# Altium schematic sheet MASTER_BLOXK.SchDoc
size B; SheetNumber: 2; SheetTotal: 5
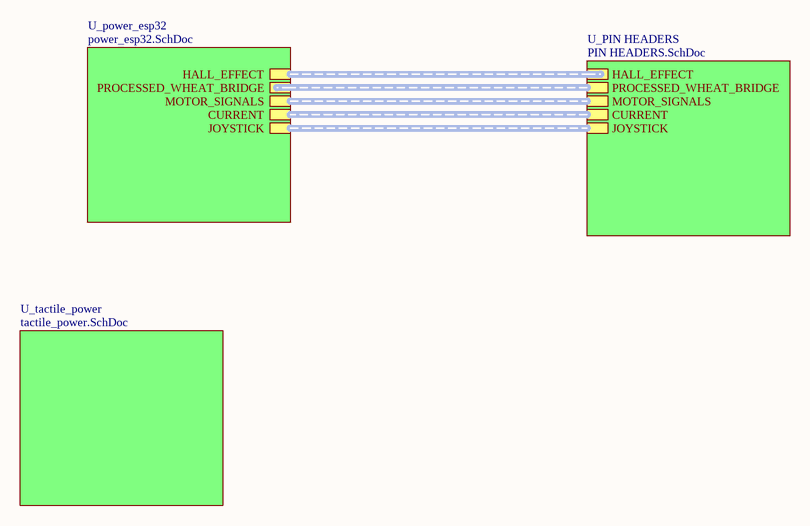
[diagram p0: MASTER_BLOXK.SchDoc]

## Sub-sheets
U_PIN HEADERS = PIN HEADERS.SchDoc: HALL_EFFECT (harness HALL_EFFECT), PROCESSED_WHEAT_BRIDGE (harness PROCES WHEAT_BRIDGE), CURRENT (harness current_sensors), MOTOR_SIGNALS (harness MOTOR_SIGNALS), JOYSTICK (harness JOY_STICK_)
U_power_esp32 = power_esp32.SchDoc: HALL_EFFECT (harness HALL_EFFECT), PROCESSED_WHEAT_BRIDGE (harness PROCES WHEAT_BRIDGE), MOTOR_SIGNALS (harness MOTOR_SIGNALS), CURRENT (harness current_sensors), JOYSTICK (harness JOY_STICK_)
U_tactile_power = tactile_power.SchDoc: no entries

## Buses and harness runs
harness sheet U_PIN HEADERS/CURRENT = sheet U_power_esp32/CURRENT
harness sheet U_PIN HEADERS/HALL_EFFECT = sheet U_power_esp32/HALL_EFFECT
harness sheet U_PIN HEADERS/JOYSTICK = sheet U_power_esp32/JOYSTICK
harness sheet U_PIN HEADERS/MOTOR_SIGNALS = sheet U_power_esp32/MOTOR_SIGNALS
harness sheet U_PIN HEADERS/PROCESSED_WHEAT_BRIDGE = sheet U_power_esp32/PROCESSED_WHEAT_BRIDGE